# Altium schematic sheet tuch-tara3.SchDoc
size A3
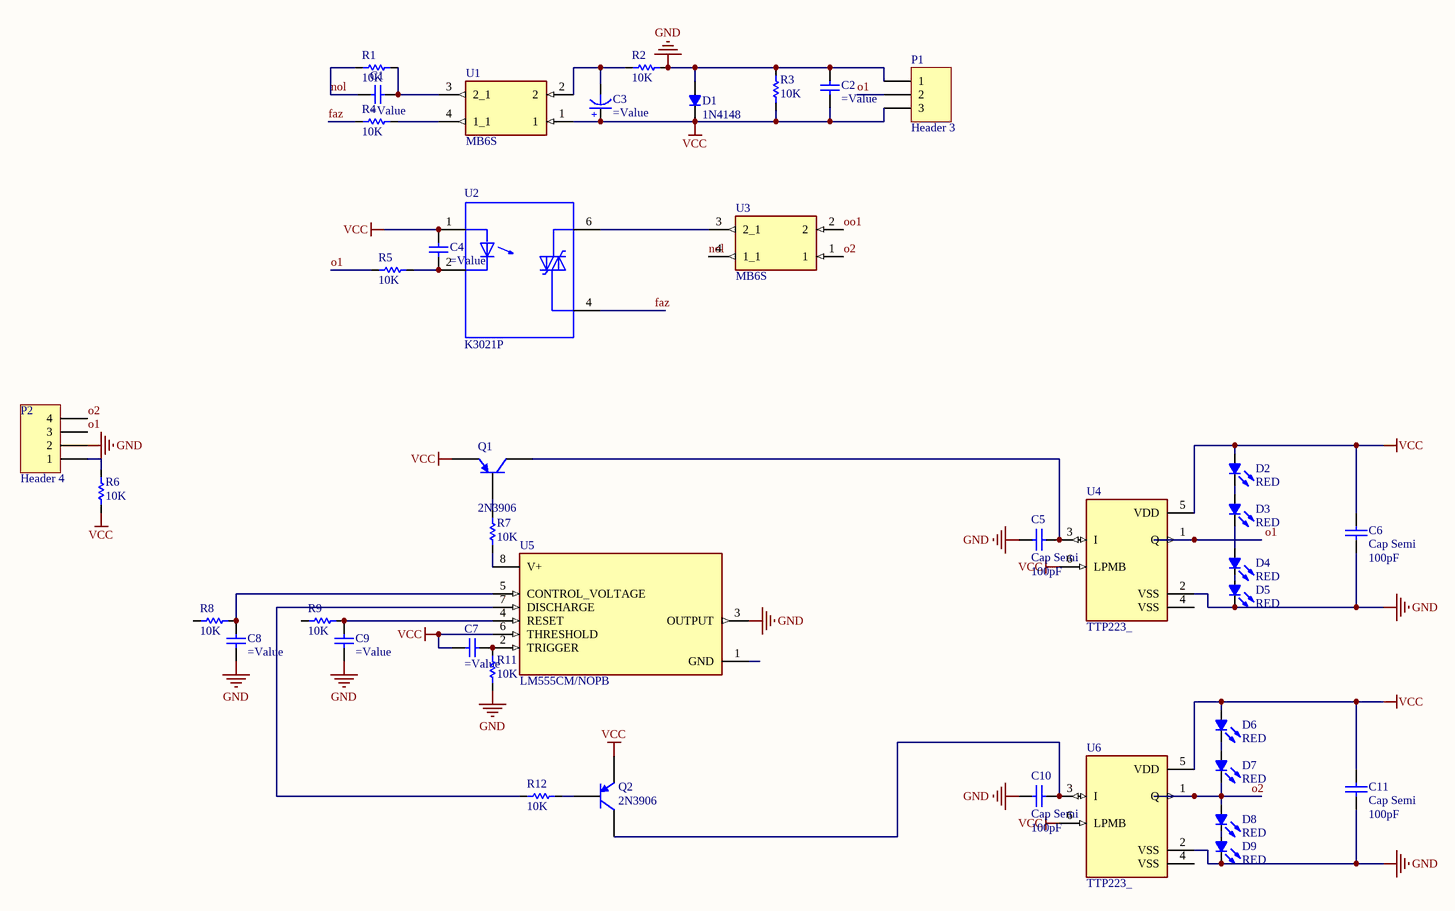
[diagram p0: tuch-tara3.SchDoc]

## Parts
C1  (no value)  [CAP-30]
C2  (no value)  [CAP 1206]
C3  (no value)  [ELEC-CAP-RAD10-20]
C4  (no value)  [CAP 1206]
C5  Cap Semi  value 100pF  [CAP 0805]
C6  Cap Semi  value 100pF  [C1206]
C7  (no value)  [CAP 0805]
C8  (no value)  [CAP 0805]
C9  (no value)  [CAP 0805]
C10  Cap Semi  value 100pF  [CAP 0805]
C11  Cap Semi  value 100pF  [C1206]
D1  MODEL: 1N4148  [DO-41]  (hidden comment: MODEL)
D2  COLOR: RED  [RES 1206 (3216X08L)]  (hidden comment: MODEL)
D3  COLOR: RED  [RES 1206 (3216X08L)]  (hidden comment: MODEL)
D4  COLOR: RED  [RES 1206 (3216X08L)]  (hidden comment: MODEL)
D5  COLOR: RED  [RES 1206 (3216X08L)]  (hidden comment: MODEL)
D6  COLOR: RED  [RES 1206 (3216X08L)]  (hidden comment: MODEL)
D7  COLOR: RED  [RES 1206 (3216X08L)]  (hidden comment: MODEL)
D8  COLOR: RED  [RES 1206 (3216X08L)]  (hidden comment: MODEL)
D9  COLOR: RED  [RES 1206 (3216X08L)]  (hidden comment: MODEL)
P1  Header 3  [HDR1X3]
P2  Header 4  [HDR1X4]
Q1  2N3906  [SOT23-3]
Q2  2N3906  [SOT23-3]
R1  10K  [RES 1206 (3216X08L)]
R2  10K  [RES 1206 (3216X08L)]
R3  10K  [RES 1206 (3216X08L)]
R4  10K  [Res-(1/1)]
R5  10K  [RES 1206 (3216X08L)]
R6  10K  [Res-(1/4)]
R7  10K  [RES 1206 (3216X08L)]
R8  10K  [RES 0805 (2012X06L)]
R9  10K  [RES 0805 (2012X06L)]
R11  10K  [RES 0805 (2012X06L)]
R12  10K  [RES 0805 (2012X06L)]
U1  MB6S  [SOIC245P670X270-4N]
U2  K3021P  [DIP762W50P254L730H410Q6]
U3  MB6S  [SOIC245P670X270-4N]
U4  TTP223_  [SOT95P285X126-6N]
U5  LM555CM/NOPB  [SOIC127P599X175-8N]
U6  TTP223_  [SOT95P285X126-6N]

## Nets
GND: C2.2(-) C5.2 C6.1 C8.2(-) C9.2(-) C10.2 C11.1 D1.1(A) D5.2(K) D9.2(K) P1.1 P2.2 R2.2 R3.2 R11.1 U4.2(VSS) U5.3(OUTPUT) U6.2(VSS)
VCC: C2.1(+) C3.2(+) C4.2(-) C6.2 C7.2(-) C11.2 D1.2(K) D2.1(A) D6.1(A) P1.3 Q1.1(E) Q2.1(E) R3.1 R6.1 U1.1 U2.1(A) U4.5(VDD) U4.6(LPMB) U5.6(THRESHOLD) U6.5(VDD) U6.6(LPMB)
faz: R4.2 U2.4(MT1)
nol: C1.1(+) R1.2 U3.4(1_1)
o1: P1.2 P2.3 R5.1
o2: D7.2(K) D8.1(A) P2.4 U3.1 U6.1(Q)
oo1: U3.2
NetC1_2: C1.2(-) R1.1 U1.3(2_1)
NetC3_1: C3.1(-) R2.1 U1.2
NetC4_1: C4.1(+) R5.2 U2.2(C)
NetC5_1: C5.1 Q1.3(C) U4.3(I)
NetC7_1: C7.1(+) R11.2 U5.2(TRIGGER)
NetC8_1: C8.1(+) R8.2 U5.5(CONTROL_VOLTAGE)
NetC9_1: C9.1(+) R9.2 U5.4(RESET)
NetC10_1: C10.1 Q2.3(C) U6.3(I)
NetD2_2: D2.2(K) D3.1(A)
NetD3_2: D3.2(K) D4.1(A)
NetD4_2: D4.2(K) D5.1(A)
NetD6_2: D6.2(K) D7.1(A)
NetD8_2: D8.2(K) D9.1(A)
NetP2_1: P2.1 R6.2
NetQ1_2: Q1.2(B) R7.2
NetQ2_2: Q2.2(B) R12.2
NetR4_1: R4.1 U1.4(1_1)
NetR7_1: R7.1 U5.8(V+)
NetR12_1: R12.1 U5.7(DISCHARGE)
NetU2_6: U2.6(MT2) U3.3(2_1)

Not connected (* = marked no-connect by the designer): R8 1; R9 1; U4 1(Q) 4(VSS); U5 1(GND); U6 4(VSS)

## Notes on the sheet
- Labels drawn without touching a wire or pin: o1

## Library data of the parts
C1 C2 C4 C7-C9 = Capacitor
C3 = Capacitor Electrolytic: Electrolytic Capacitor
C5 C6 C10 C11 = Cap Semi: Capacitor (Semiconductor SIM Model); Published: 8-Jun-2000; LatestRevisionDate: 29-May-2009; LatestRevisionNote: IPC-7351 Footprint Added.; PackageReference: C1206; Publisher: Altium Limited; PackageDescription: Chip Capacitor
D1 = Diode
D2-D9 = LED 5mm: Typical LED
P1 = Header 3: Header, 3-Pin; LatestRevisionDate: 17-Jul-2002; LatestRevisionNote: Re-released for DXP Platform.; Publisher: Altium Limited
P2 = Header 4: Header, 4-Pin; LatestRevisionDate: 17-Jul-2002; LatestRevisionNote: Re-released for DXP Platform.; Publisher: Altium Limited
Q1 Q2 = 2N3906: PNP General Purpose Amplifier; pin to pad: 1>2 2>1; Published: 8-Jun-2000; LatestRevisionDate: 15-Jan-2003; LatestRevisionNote: PCB Footprint 'BCY-W3/D4.7' replaced; DatasheetVersion: 1997; PackageVersion: Sep-1998; PackageReference: TO-92A; Publisher: Altium Limited; PackageDescription: TO, Flat Index; 3 In-Line, Axial Leads; Body Dia. 4.5mm; Leads 0.51 x 0.48 mm (max); ComponentLink1Description: Manufacturer Link; ComponentLink1URL: http://www.fairchildsemi.com/; ComponentLink2Description: Datasheet; ComponentLink2URL: http://www.fairchildsemi.com/ds/2N%2F2N3906.pdf
R1-R9 R11 R12 = Resistor: Tolerance: 5%; Power: 1/4 W; Value: 10K
U1 U3 = MB6S: Bridge Rectifier Single Phase Standard 600V Surface Mount 4-SOIC; MF: ON Semiconductor; Digi-Key_Purchase_URL: https://www.digikey.com.tr/product-detail/en/on-semiconductor/MB6S/MB6SCT-ND/965654?utm_source=snapeda&utm_medium=aggregator&utm_campaign=symbol; Value: *; Package: BESOP-4 Surge Components; Digi-Key_Part_Number: MB6SCT-ND; SnapEDA_Link: https://www.snapeda.com/parts/MB6S/ON%20Semiconductor/view-part/2774209/?ref=snap; MP: MB6S
U2 = K3021P: Optoisolator Triac Output 5300Vrms 1 Channel 6-DIP; MF: Vishay Semiconductor; Package: DIP-6 Vishay; Availability: Unavailable; Value: *; MP: K3021P; Mouser-Purchase-URL: https://snapeda.com/shop?store=Mouser&id=291595; SnapEDA_Link: https://www.snapeda.com/parts/K3021P/Vishay%20Semiconductor%20Opto%20Division/view-part/291595/?ref=snap; Price: None; DigiKey-Purchase-URL: https://snapeda.com/shop?store=DigiKey&id=291595
U4 U6 = TTP223_: 22 kOhms Â±5% 0.1W, 1/10W Chip Resistor 0402 _1005 Metric_ Automotive AEC-Q200, Moisture Resistant Thick Film; MP: TTP223; MF: KOA Speer; Price: None; SnapEDA_Link: https://www.snapeda.com/parts/TTP223%20/KOA%20Speer/view-part/2780209/?ref=snap; Package: 0402 KOA Speer; Availability: Unavailable; Value: *
U5 = LM555CM/NOPB: Highly Stable 555 Timer 8-SOIC 0 to 70; Price: None; MP: LM555CM/NOPB; Availability: Unavailable; Value: *; Package: None